# EAGLE schematic DIDV (EAGLE 6.2)
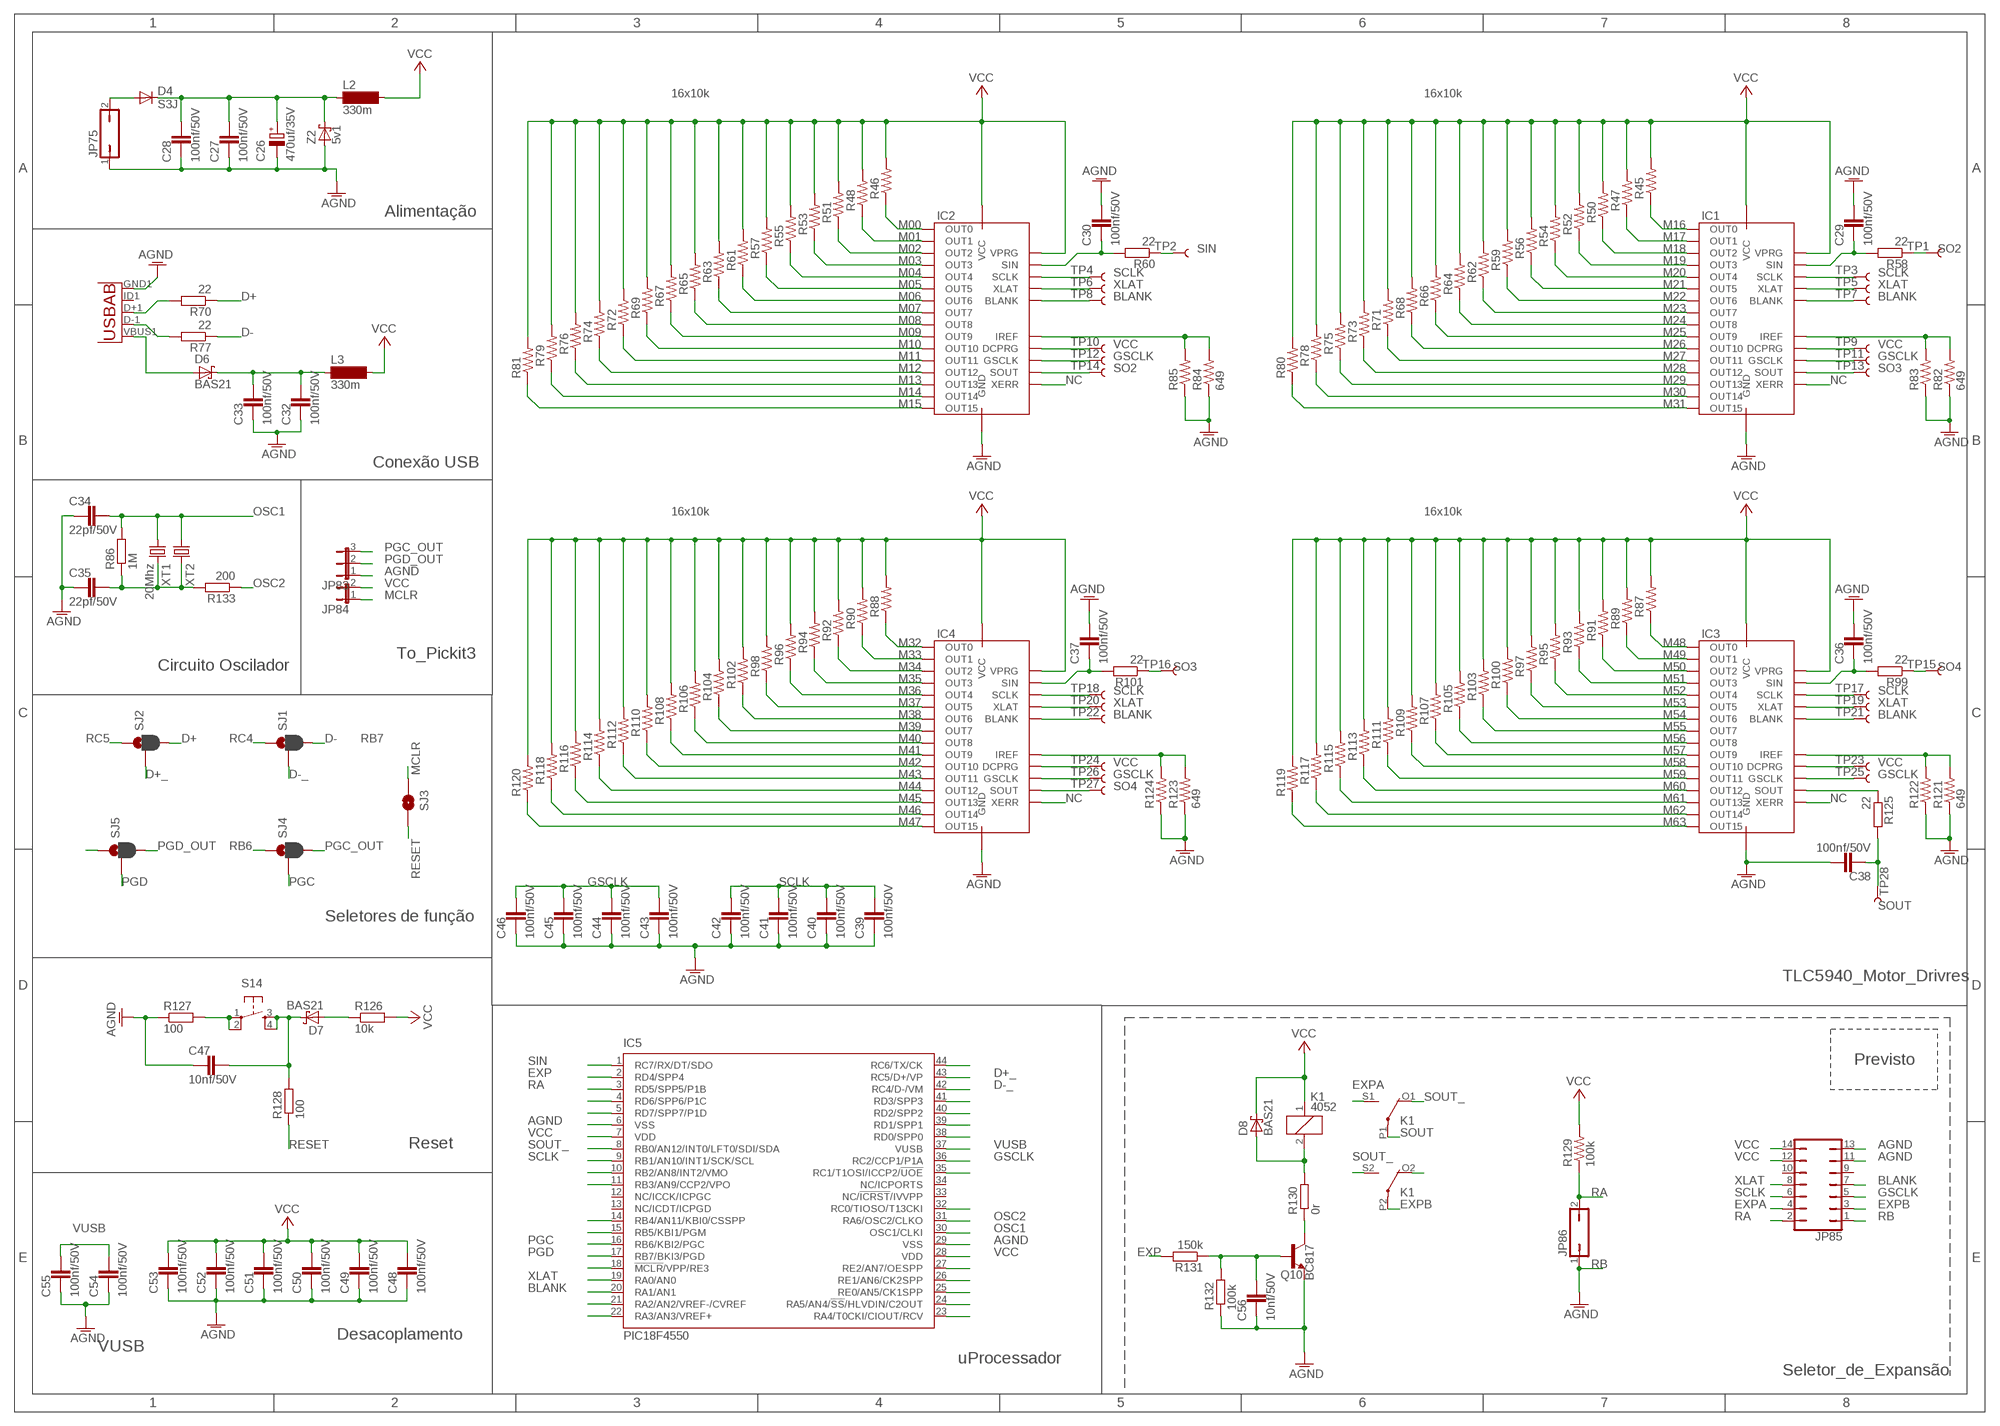
[diagram p0: schematic, sheet 1]

## Parts
C26  470uf/35V  CPOL-EU140CLH-1014  [140CLH-1014]
C27  100nf/50V  C-EUC0805  [C0805]
C28  100nf/50V  C-EUC0805  [C0805]
C29  100nf/50V  C-EUC0603K  [C0603K]
C30  100nf/50V  C-EUC0603K  [C0603K]
C32  100nf/50V  C-EUC0805  [C0805]
C33  100nf/50V  C-EUC0805  [C0805]
C34  22pf/50V  C-EUC0603K  [C0603K]
C35  22pf/50V  C-EUC0603K  [C0603K]
C36  100nf/50V  C-EUC0603K  [C0603K]
C37  100nf/50V  C-EUC0603K  [C0603K]
C38  100nf/50V  C-EUC0603K  [C0603K]
C39  100nf/50V  C-EUC0603K  [C0603K]
C40  100nf/50V  C-EUC0603K  [C0603K]
C41  100nf/50V  C-EUC0603K  [C0603K]
C42  100nf/50V  C-EUC0603K  [C0603K]
C43  100nf/50V  C-EUC0603K  [C0603K]
C44  100nf/50V  C-EUC0603K  [C0603K]
C45  100nf/50V  C-EUC0603K  [C0603K]
C46  100nf/50V  C-EUC0603K  [C0603K]
C47  10nf/50V  C-EUC0603K  [C0603K]
C48  100nf/50V  C-EUC0805  [C0805]
C49  100nf/50V  C-EUC0805  [C0805]
C50  100nf/50V  C-EUC0805  [C0805]
C51  100nf/50V  C-EUC0805  [C0805]
C52  100nf/50V  C-EUC0805  [C0805]
C53  100nf/50V  C-EUC0805  [C0805]
C54  100nf/50V  C-EUC0805  [C0805]
C55  100nf/50V  C-EUC0805  [C0805]
C56  10nf/50V  C-EUC0603K  [C0603K]
D4  S3J  DIODE-SMC  [SMC]
D6  BAS21  BAS40  [SOT23]
D7  BAS21  BAS40  [SOT23]
D8  BAS21  BAS40  [SOT23]
IC1  IC-PACKAGE_DIL28-3  [IC-PACKAGE_DIL28-3]
IC2  IC-PACKAGE_DIL28-3  [IC-PACKAGE_DIL28-3]
IC3  IC-PACKAGE_DIL28-3  [IC-PACKAGE_DIL28-3]
IC4  IC-PACKAGE_DIL28-3  [IC-PACKAGE_DIL28-3]
IC5  PIC18F4550  PIC18F4550_TQFP  [TQFP44]
JP75  JP1Q  [JP1]
JP83  JP2E  [JP2]
JP84  JP1E  [JP1]
JP85  JP7Q  [JP7Q]
JP86  JP1Q  [JP1]
K1  4052  [F4052]
L2  330m  MS50  [MS50]
L3  330m  MS50  [MS50]
Q10  BC817  BC817-16LT1SMD  [SOT23-BEC]
R45  R-US_R0805  [R0805]
R46  R-US_R0805  [R0805]
R47  R-US_R0805  [R0805]
R48  R-US_R0805  [R0805]
R50  R-US_R0805  [R0805]
R51  R-US_R0805  [R0805]
R52  R-US_R0805  [R0805]
R53  R-US_R0805  [R0805]
R54  R-US_R0805  [R0805]
R55  R-US_R0805  [R0805]
R56  R-US_R0805  [R0805]
R57  R-US_R0805  [R0805]
R58  22  R-EU_R0603  [R0603]
R59  R-US_R0805  [R0805]
R60  22  R-EU_R0603  [R0603]
R61  R-US_R0805  [R0805]
R62  R-US_R0805  [R0805]
R63  R-US_R0805  [R0805]
R64  R-US_R0805  [R0805]
R65  R-US_R0805  [R0805]
R66  R-US_R0805  [R0805]
R67  R-US_R0805  [R0805]
R68  R-US_R0805  [R0805]
R69  R-US_R0805  [R0805]
R70  22  R-EU_R0603  [R0603]
R71  R-US_R0805  [R0805]
R72  R-US_R0805  [R0805]
R73  R-US_R0805  [R0805]
R74  R-US_R0805  [R0805]
R75  R-US_R0805  [R0805]
R76  R-US_R0805  [R0805]
R77  22  R-EU_R0603  [R0603]
R78  R-US_R0805  [R0805]
R79  R-US_R0805  [R0805]
R80  R-US_R0805  [R0805]
R81  R-US_R0805  [R0805]
R82  649  R-US_R0805  [R0805]
R83  R-US_R0805  [R0805]
R84  649  R-US_R0805  [R0805]
R85  R-US_R0805  [R0805]
R86  1M  R-EU_R0603  [R0603]
R87  R-US_R0805  [R0805]
R88  R-US_R0805  [R0805]
R89  R-US_R0805  [R0805]
R90  R-US_R0805  [R0805]
R91  R-US_R0805  [R0805]
R92  R-US_R0805  [R0805]
R93  R-US_R0805  [R0805]
R94  R-US_R0805  [R0805]
R95  R-US_R0805  [R0805]
R96  R-US_R0805  [R0805]
R97  R-US_R0805  [R0805]
R98  R-US_R0805  [R0805]
R99  22  R-EU_R0603  [R0603]
R100  R-US_R0805  [R0805]
R101  22  R-EU_R0603  [R0603]
R102  R-US_R0805  [R0805]
R103  R-US_R0805  [R0805]
R104  R-US_R0805  [R0805]
R105  R-US_R0805  [R0805]
R106  R-US_R0805  [R0805]
R107  R-US_R0805  [R0805]
R108  R-US_R0805  [R0805]
R109  R-US_R0805  [R0805]
R110  R-US_R0805  [R0805]
R111  R-US_R0805  [R0805]
R112  R-US_R0805  [R0805]
R113  R-US_R0805  [R0805]
R114  R-US_R0805  [R0805]
R115  R-US_R0805  [R0805]
R116  R-US_R0805  [R0805]
R117  R-US_R0805  [R0805]
R118  R-US_R0805  [R0805]
R119  R-US_R0805  [R0805]
R120  R-US_R0805  [R0805]
R121  649  R-US_R0805  [R0805]
R122  R-US_R0805  [R0805]
R123  649  R-US_R0805  [R0805]
R124  R-US_R0805  [R0805]
R125  22  R-EU_R0603  [R0603]
R126  10k  R-EU_R0603  [R0603]
R127  100  R-EU_R0603  [R0603]
R128  100  R-EU_R0603  [R0603]
R129  100k  R-US_R0805  [R0805]
R130  0r  R-EU_R0603  [R0603]
R131  150k  R-EU_R0603  [R0603]
R132  100k  R-EU_R0603  [R0603]
R133  200  R-EU_R0603  [R0603]
S14  TAC_SWITCHSMD  [TACTILE-SWITCH-SMD]
SJ1  JUMPER-PAD-3-2OF3_NC_BY_PASTE  [PAD-JUMPER-3-2OF3_NC_BY_PASTE_YES_SILK_FULL_BOX]
SJ2  JUMPER-PAD-3-2OF3_NC_BY_PASTE  [PAD-JUMPER-3-2OF3_NC_BY_PASTE_YES_SILK_FULL_BOX]
SJ3  JUMPER-PAD-2-NOYES_SILK  [PAD-JUMPER-2-NO_YES_SILK]
SJ4  JUMPER-PAD-3-2OF3_NC_BY_PASTE  [PAD-JUMPER-3-2OF3_NC_BY_PASTE_YES_SILK_FULL_BOX]
SJ5  JUMPER-PAD-3-2OF3_NC_BY_PASTE  [PAD-JUMPER-3-2OF3_NC_BY_PASTE_YES_SILK_FULL_BOX]
TP1  TEST-POINT3X4  [PAD.03X.04]
TP2  TEST-POINT3X4  [PAD.03X.04]
TP3  TEST-POINT3X4  [PAD.03X.04]
TP4  TEST-POINT3X4  [PAD.03X.04]
TP5  TEST-POINT3X4  [PAD.03X.04]
TP6  TEST-POINT3X4  [PAD.03X.04]
TP7  TEST-POINT3X4  [PAD.03X.04]
TP8  TEST-POINT3X4  [PAD.03X.04]
TP9  TEST-POINT3X4  [PAD.03X.04]
TP10  TEST-POINT3X4  [PAD.03X.04]
TP11  TEST-POINT3X4  [PAD.03X.04]
TP12  TEST-POINT3X4  [PAD.03X.04]
TP13  TEST-POINT3X4  [PAD.03X.04]
TP14  TEST-POINT3X4  [PAD.03X.04]
TP15  TEST-POINT3X4  [PAD.03X.04]
TP16  TEST-POINT3X4  [PAD.03X.04]
TP17  TEST-POINT3X4  [PAD.03X.04]
TP18  TEST-POINT3X4  [PAD.03X.04]
TP19  TEST-POINT3X4  [PAD.03X.04]
TP20  TEST-POINT3X4  [PAD.03X.04]
TP21  TEST-POINT3X4  [PAD.03X.04]
TP22  TEST-POINT3X4  [PAD.03X.04]
TP23  TEST-POINT3X4  [PAD.03X.04]
TP24  TEST-POINT3X4  [PAD.03X.04]
TP25  TEST-POINT3X4  [PAD.03X.04]
TP26  TEST-POINT3X4  [PAD.03X.04]
TP27  TEST-POINT3X4  [PAD.03X.04]
TP28  TEST-POINT3X4  [PAD.03X.04]
U1  USB-ABCONN-11794  [USB-AB-MICRO-SMD_V03]
XT1  20Mhz  CRYSTALHC49UP  [HC49UP]
XT2  CRYSTALHC49U-V  [HC49U-V]
Z2  5v1  BAS70  [SOT23]

## Nets
AGND: C26.- C27.2 C28.2 C29.1 C30.1 C32.2 C33.2 C34.2 C35.2 C36.1 C37.1 C38.1 C39.2 C40.2 C41.2 C42.2 C43.2 C44.2 C45.2 C46.2 C47.2 C48.2 C49.2 C50.2 C51.2 C52.2 C53.2 C54.2 C55.2 C56.2 IC1.22(GND) IC2.22(GND) IC3.22(GND) IC4.22(GND) IC5.6(VSS) IC5.29(VSS) JP75.1 JP83.1 JP85.11 JP85.13 Q10.E R82.1 R83.1 R84.1 R85.1 R121.1 R122.1 R123.1 R124.1 R127.1 R132.1 U1.GND1(GND) Z2.1(A)
BLANK: IC1.23(BLANK) IC2.23(BLANK) IC3.23(BLANK) IC4.23(BLANK) IC5.20(RA1/AN1) JP85.7 TP7.P$1 TP8.P$1 TP21.P$1 TP22.P$1
D+: R70.1 SJ2.3
D+_: IC5.43(RC5/D+/VP) SJ2.2
D-: R77.1 SJ1.3
D-_: IC5.42(RC4/D-/VM) SJ1.2
EXP: IC5.2(RD4/SPP4) R131.2
EXPA: JP85.4 K1.S1(2:S)
EXPB: JP85.3 K1.P2(3:P)
GSCLK: C43.1 C44.1 C45.1 C46.1 IC1.18(GSCLK) IC2.18(GSCLK) IC3.18(GSCLK) IC4.18(GSCLK) IC5.36(RC2/CCP1/P1A) JP85.5 TP11.P$1 TP12.P$1 TP25.P$1 TP26.P$1
M00: IC2.28(OUT0) R46.1
M01: IC2.1(OUT1) R48.1
M02: IC2.2(OUT2) R51.1
M03: IC2.3(OUT3) R53.1
M04: IC2.4(OUT4) R55.1
M05: IC2.5(OUT5) R57.1
M06: IC2.6(OUT6) R61.1
M07: IC2.7(OUT7) R63.1
M08: IC2.8(OUT8) R65.1
M09: IC2.9(OUT9) R67.1
M10: IC2.10(OUT10) R69.1
M11: IC2.11(OUT11) R72.1
M12: IC2.12(OUT12) R74.1
M13: IC2.13(OUT13) R76.1
M14: IC2.14(OUT14) R79.1
M15: IC2.15(OUT15) R81.1
M16: IC1.28(OUT0) R45.1
M17: IC1.1(OUT1) R47.1
M18: IC1.2(OUT2) R50.1
M19: IC1.3(OUT3) R52.1
M20: IC1.4(OUT4) R54.1
M21: IC1.5(OUT5) R56.1
M22: IC1.6(OUT6) R59.1
M23: IC1.7(OUT7) R62.1
M24: IC1.8(OUT8) R64.1
M25: IC1.9(OUT9) R66.1
M26: IC1.10(OUT10) R68.1
M27: IC1.11(OUT11) R71.1
M28: IC1.12(OUT12) R73.1
M29: IC1.13(OUT13) R75.1
M30: IC1.14(OUT14) R78.1
M31: IC1.15(OUT15) R80.1
M32: IC4.28(OUT0) R88.1
M33: IC4.1(OUT1) R90.1
M34: IC4.2(OUT2) R92.1
M35: IC4.3(OUT3) R94.1
M36: IC4.4(OUT4) R96.1
M37: IC4.5(OUT5) R98.1
M38: IC4.6(OUT6) R102.1
M39: IC4.7(OUT7) R104.1
M40: IC4.8(OUT8) R106.1
M41: IC4.9(OUT9) R108.1
M42: IC4.10(OUT10) R110.1
M43: IC4.11(OUT11) R112.1
M44: IC4.12(OUT12) R114.1
M45: IC4.13(OUT13) R116.1
M46: IC4.14(OUT14) R118.1
M47: IC4.15(OUT15) R120.1
M48: IC3.28(OUT0) R87.1
M49: IC3.1(OUT1) R89.1
M50: IC3.2(OUT2) R91.1
M51: IC3.3(OUT3) R93.1
M52: IC3.4(OUT4) R95.1
M53: IC3.5(OUT5) R97.1
M54: IC3.6(OUT6) R100.1
M55: IC3.7(OUT7) R103.1
M56: IC3.8(OUT8) R105.1
M57: IC3.9(OUT9) R107.1
M58: IC3.10(OUT10) R109.1
M59: IC3.11(OUT11) R111.1
M60: IC3.12(OUT12) R113.1
M61: IC3.13(OUT13) R115.1
M62: IC3.14(OUT14) R117.1
M63: IC3.15(OUT15) R119.1
MCLR: JP84.1 SJ3.1
N$126: IC5.27(RE2/AN7/OESPP)
N$127: IC5.26(RE1/AN6/CK2SPP)
N$128: IC5.25(RE0/AN5/CK1SPP)
N$129: IC5.24(RA5/AN4/!SS!/HLVDIN/C2OUT)
N$130: IC5.23(RA4/T0CKI/CIOUT/RCV)
N$131: IC5.14(RB4/AN11/KBI0/CSSPP)
N$132: IC5.15(RB5/KBI1/PGM)
N$133: IC5.22(RA3/AN3/VREF+)
N$134: R127.2 S14.1 S14.2
N$135: C47.1 D7.3(C) R128.2 S14.3 S14.4
N$136: D7.1(A) R126.1
N$137: D4.A JP75.2
N$138: C26.+ C27.1 C28.1 D4.C L2.1 Z2.3(C)
N$139: R70.2 U1.D+1(D+)
N$140: R77.2 U1.D-1(D-)
N$141: D6.1(A) U1.VBUS1(VBUS)
N$142: IC1.20(IREF) R82.2 R83.2
N$143: IC3.20(IREF) R121.2 R122.2
N$145: IC4.20(IREF) R123.2 R124.2
N$146: IC2.20(IREF) R84.2 R85.2
N$147: C32.1 C33.1 D6.3(C) L3.1
N$148: C30.2 IC2.26(SIN) R60.2
N$149: C29.2 IC1.26(SIN) R58.2
N$150: C37.2 IC4.26(SIN) R101.2
N$151: C36.2 IC3.26(SIN) R99.2
N$152: IC3.17(SOUT) R125.1
N$153: IC5.35(RC1/T1OSI/ICCP2/!UOE)
N$154: IC5.38(RD0/SPP0)
N$155: IC5.39(RD1/SPP1)
N$156: IC5.40(RD2/SPP2)
N$157: IC5.41(RD3/SPP3)
N$158: IC5.44(RC6/TX/CK)
N$159: IC5.32(RC0/TIOSO/T13CKI)
N$160: IC5.21(RA2/AN2/VREF-/CVREF)
N$161: IC5.18(!MCLR!/VPP/RE3)
N$162: IC5.10(RB2/AN8/INT2/VMO)
N$163: IC5.11(RB3/AN9/CCP2/VPO)
N$164: IC5.5(RD7/SPP7/P1D)
N$165: IC5.4(RD6/SPP6/P1C)
N$166: Q10.C R130.1
N$167: C56.1 Q10.B R131.1 R132.2
N$168: D8.1(A) K1.2 R130.2
N$169: K1.O2(3:O)
NC: IC1.16(XERR) IC2.16(XERR) IC3.16(XERR) IC4.16(XERR)
OSC1: C34.1 IC5.30(OSC1/CLKI) R86.2 XT1.1 XT2.1
OSC2: C35.1 IC5.31(RA6/OSC2/CLKO) R86.1 R133.1 R133.2 XT1.2 XT2.2
PGC: IC5.16(RB6/KBI2/PGC) SJ4.2
PGC_OUT: JP83.3 SJ4.3
PGD: IC5.17(RB7/BKI3/PGD) SJ5.2
PGD_OUT: JP83.2 SJ5.3
RA: IC5.3(RD5/SPP5/P1B) JP85.2 JP86.2 R129.1
RB: JP85.1 JP86.1 ; supply symbol labelled AGND
RB6: SJ4.1
RB7: SJ5.1
RC4: SJ1.1
RC5: SJ2.1
RESET: R128.1 SJ3.2
SCLK: C39.1 C40.1 C41.1 C42.1 IC1.25(SCLK) IC2.25(SCLK) IC3.25(SCLK) IC4.25(SCLK) IC5.9(RB1/AN10/INT1/SCK/SCL) JP85.6 TP3.P$1 TP4.P$1 TP17.P$1 TP18.P$1
SIN: IC5.1(RC7/RX/DT/SDO) R60.1 TP2.P$1
SO2: IC2.17(SOUT) R58.1 TP1.P$1 TP14.P$1
SO3: IC1.17(SOUT) R101.1 TP13.P$1 TP16.P$1
SO4: IC4.17(SOUT) R99.1 TP15.P$1 TP27.P$1
SOUT: C38.2 K1.P1(2:P) R125.2 TP28.P$1
SOUT_: IC5.8(RB0/AN12/INT0/LFT0/SDI/SDA) K1.O1(2:O) K1.S2(3:S)
VCC: C48.1 C49.1 C50.1 C51.1 C52.1 C53.1 D8.3(C) IC1.19(DCPRG) IC1.21(VCC) IC1.27(VPRG) IC2.19(DCPRG) IC2.21(VCC) IC2.27(VPRG) IC3.19(DCPRG) IC3.21(VCC) IC3.27(VPRG) IC4.19(DCPRG) IC4.21(VCC) IC4.27(VPRG) IC5.7(VDD) IC5.28(VDD) JP84.2 JP85.12 JP85.14 K1.1 L2.2 L3.2 R45.2 R46.2 R47.2 R48.2 R50.2 R51.2 R52.2 R53.2 R54.2 R55.2 R56.2 R57.2 R59.2 R61.2 R62.2 R63.2 R64.2 R65.2 R66.2 R67.2 R68.2 R69.2 R71.2 R72.2 R73.2 R74.2 R75.2 R76.2 R78.2 R79.2 R80.2 R81.2 R87.2 R88.2 R89.2 R90.2 R91.2 R92.2 R93.2 R94.2 R95.2 R96.2 R97.2 R98.2 R100.2 R102.2 R103.2 R104.2 R105.2 R106.2 R107.2 R108.2 R109.2 R110.2 R111.2 R112.2 R113.2 R114.2 R115.2 R116.2 R117.2 R118.2 R119.2 R120.2 R126.2 R129.2 TP9.P$1 TP10.P$1 TP23.P$1 TP24.P$1
VUSB: C54.1 C55.1 IC5.37(VUSB)
XLAT: IC1.24(XLAT) IC2.24(XLAT) IC3.24(XLAT) IC4.24(XLAT) IC5.19(RA0/AN0) JP85.8 TP5.P$1 TP6.P$1 TP19.P$1 TP20.P$1
Unconnected: IC5.12(NC/ICCK/ICPGC) IC5.13(NC/ICDT/ICPGD) IC5.33(NC/!ICRST!/IVVPP) IC5.34(NC/ICPORTS) JP85.9 JP85.10 U1.ID1(USBID)

## Notes on the sheet
- 16x10k | 16x10k
- Alimentação
- Conexão USB
- 16x10k | 16x10k
- To_Pickit3
- Circuito Oscilador
- Seletores de função
- TLC5940_Motor_Drivres
- Previsto
- Reset
- Desacoplamento
- VUSB
- uProcessador
- Seletor_de_Expansão

## Library data of the parts
C26 = rcl:CPOL-EU: POLARIZED CAPACITOR, European symbol
C27-C30 C32-C56 = rcl:C-EU: CAPACITOR, European symbol
D4 = diode:DIODE-: DIODE
D6-D8 = diode:BAS40: Silicon Schottky Diodes General-purpose diode for high-speed switching
IC1-IC4 = TLC5940:IC-PACKAGE_DIL28: Dual In Line
IC5 = microchip:PIC18F4*_TQFP: USB Microcontrollers with nanoWatt Technology High-Performance, Enhanced Flash, 28/40/44-Pin, Source: http://ww1.microchip.com/downloads/en/devicedoc/39632c.pdf; MF: MICROCHIP; MPN: PIC18F4550-I/PT; OC_FARNELL: 9321365; OC_NEWARK: 08J9633
JP75 JP86 = jumper:JP1Q: JUMPER
JP83 = jumper:JP2E: JUMPER
JP84 = jumper:JP1E: JUMPER
JP85 = jumper:JP7Q: JUMPER
K1 = relay:4052: RELAY 2 x switch, Finder; OC_FARNELL: unknown; OC_NEWARK: unknown
L2 L3 = inductor-neosid:MS50: INDUCTOR SMD power inductor; OC_FARNELL: unknown; OC_NEWARK: unknown
Q10 = transistor-npn:BC817*: NPN Transistor
R45-R48 R50-R57 R59 R61-R69 R71-R76 R78-R85 R87-R98 R100 R102-R124 R129 = rcl:R-US_: RESISTOR, American symbol
R58 R60 R70 R77 R86 R99 R101 R125-R128 R130-R133 = rcl:R-EU_: RESISTOR, European symbol
S14 = SparkFun-Electromechanical:TAC_SWITCH: Momentary Switch Button commonly used for reset or general input. Spark Fun Electronics SKU : COM-00097 SMT- SWCH-08247
SJ1 SJ2 SJ4 SJ5 = SparkFun-Passives:JUMPER-PAD-3-2OF3_NC_BY_PASTE
SJ3 = SparkFun-Passives:JUMPER-PAD-2-NO
TP1-TP28 = SparkFun-Passives:TEST-POINT: Bare copper test points for troubleshooting or ICT
U1 = SparkFun-Connectors:USB-AB: This is a USB AB connector that is compatible with USB OTG. i.e. this connector can serve as a host or device; PROD_ID: CONN-11794
XT1 = crystal:CRYSTAL: CRYSTAL; OC_FARNELL: unknown; OC_NEWARK: unknown
XT2 = crystal:CRYSTAL: CRYSTAL; OC_FARNELL: 1666969; OC_NEWARK: unknown
Z2 = diode:BAS70: Silicon Schottky Diodes General-purpose diode for high-speed switching